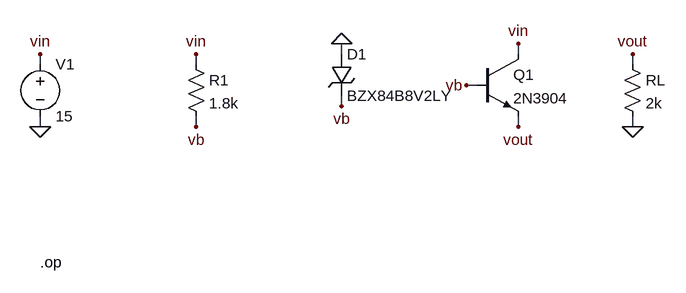
[diagram p0: schematic series_regulator.asc]
series_regulator.asc, the LTspice schematic file:
Version 4.1
SHEET 1 1152 808
SYMBOL voltage 112 160 R0
SYMATTR InstName V1
SYMATTR Value 15
SYMBOL res 336 160 R0
SYMATTR InstName R1
SYMATTR Value 1.8k
SYMBOL zener 560 160 R0
SYMATTR InstName D1
SYMATTR Value BZX84B8V2LY
SYMBOL npn 784 160 R0
SYMATTR InstName Q1
SYMATTR Value 2N3904
SYMBOL res 1008 160 R0
SYMATTR InstName RL
SYMATTR Value 2k
WIRE 112 176 112 160
WIRE 352 176 352 160
WIRE 848 160 848 144
WIRE 352 256 352 272
WIRE 576 224 576 240
WIRE 784 208 768 208
WIRE 848 256 848 272
WIRE 1024 176 1024 160
WIRE 112 256 112 272
WIRE 576 160 576 144
WIRE 1024 256 1024 272
FLAG 112 160 vin
FLAG 352 160 vin
FLAG 848 144 vin
FLAG 352 272 vb
FLAG 576 240 vb
FLAG 768 208 vb
FLAG 848 272 vout
FLAG 1024 160 vout
FLAG 112 272 0
FLAG 576 144 0
FLAG 1024 272 0
TEXT 112 480 Left 2 !.op

The netlist it stands for:
* series_regulator.asc
V1 vin 0 15
R1 vin vb 1.8k
D1 0 vb BZX84B8V2LY
Q1 vin vb vout 0 2N3904
RL vout 0 2k
.model D D
.lib standard.dio
.model NPN NPN
.model PNP PNP
.lib standard.bjt
.op
.backanno
.end